# EAGLE schematic step_up_converter (EAGLE 7.1.0)
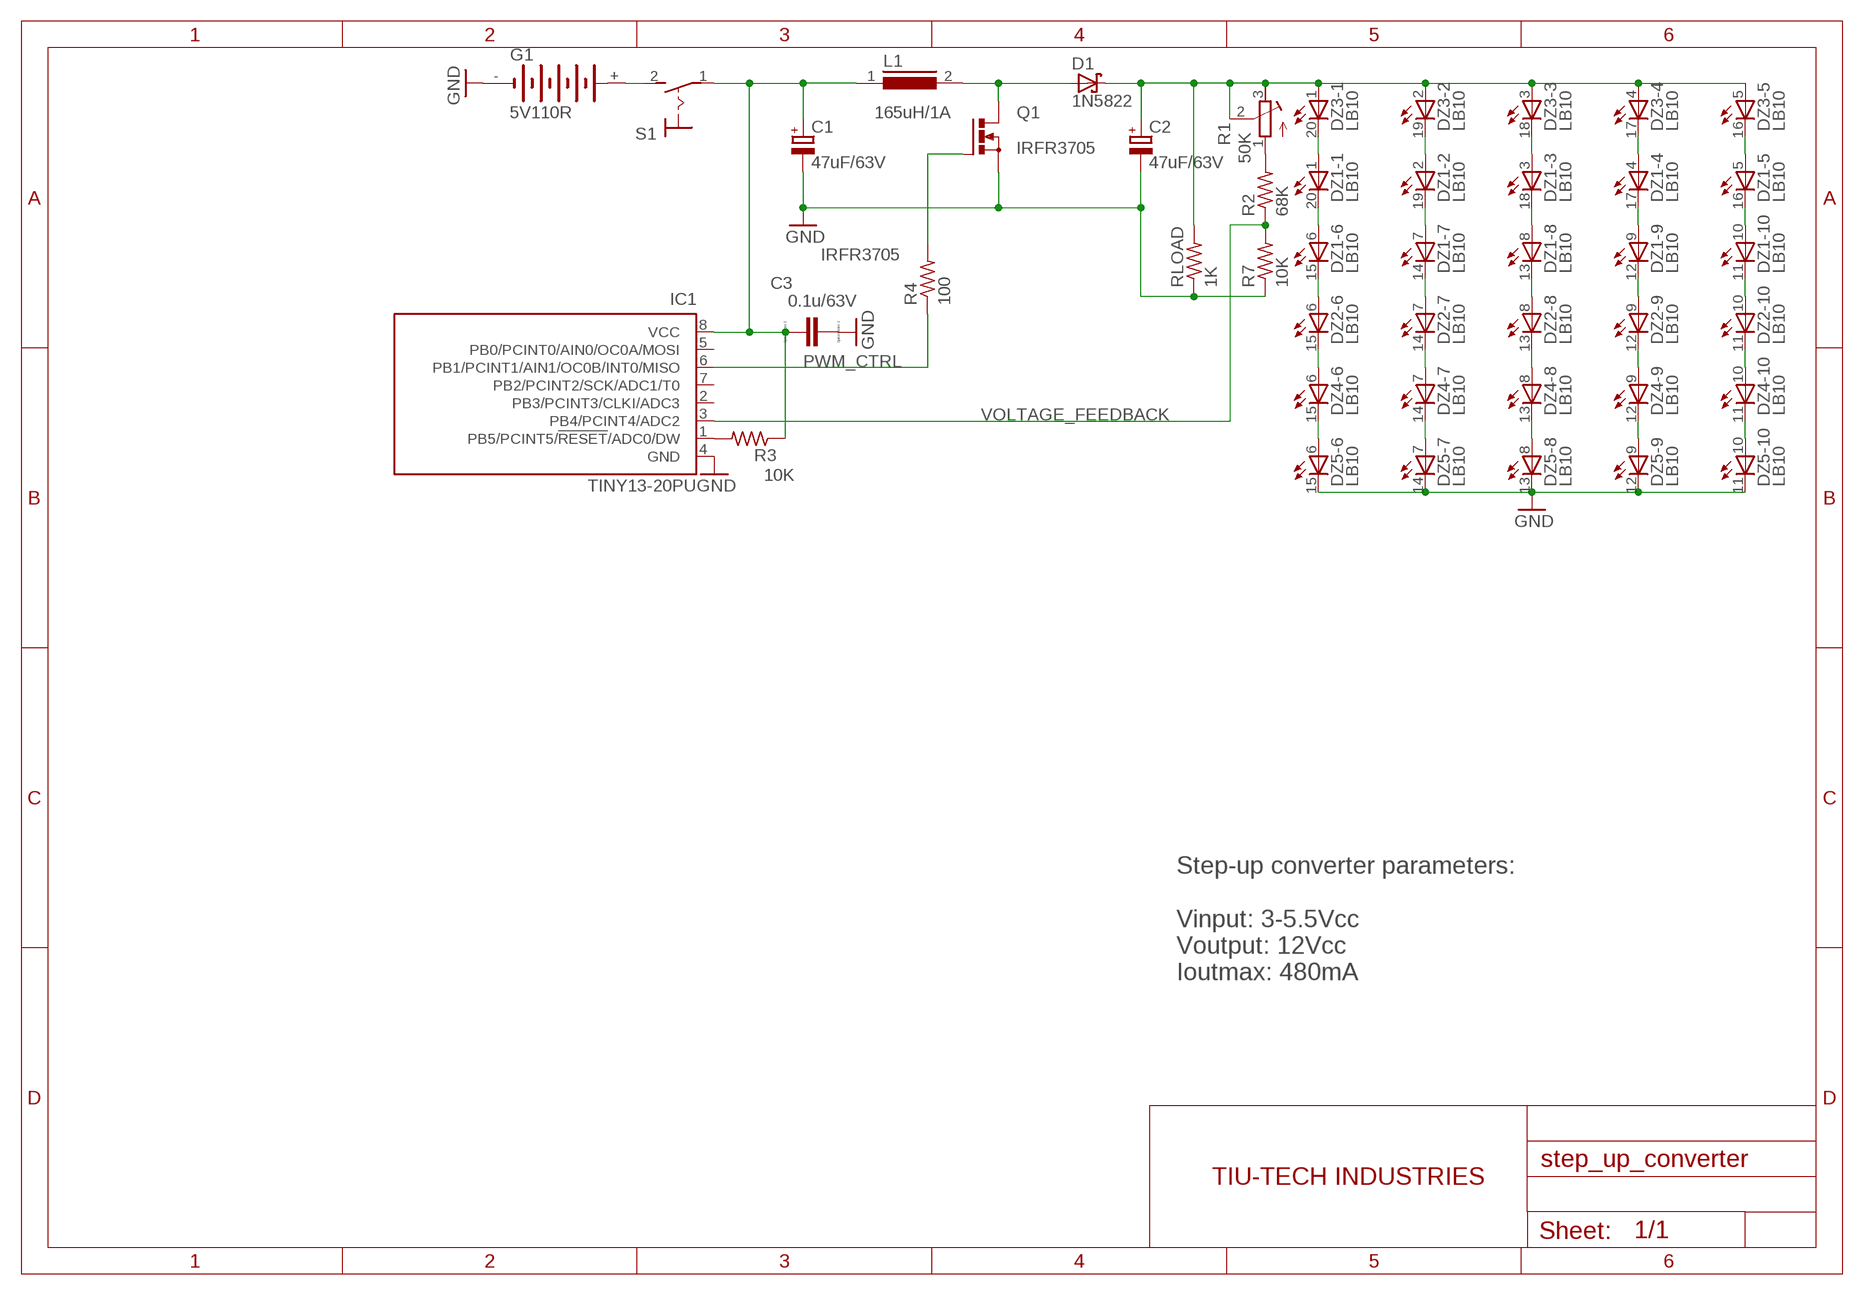
[diagram p0: schematic, sheet 1]

## Parts
C1  47uF/63V  CPOL-EUE2.5-6  [E2,5-6]
C2  47uF/63V  CPOL-EUE2.5-6  [E2,5-6]
C3  0.1u/63V  C-EU025-024X044  [C025-024X044]
D1  1N5822  SCHOTTKY-DIODECB429-17  [CB429-17]
DZ1  LB10  [LB10]
DZ2  LB10  [LB10]
DZ3  LB10  [LB10]
DZ4  LB10  [LB10]
DZ5  LB10  [LB10]
G1  5V110R  [5V110R]
IC1  TINY13-20PU  [DIL08]
L1  82114R  [82114R]
R1  50K  R-TRIMM64P  [RTRIM64P]
R2  68K  R-US_0204/5  [0204/5]
R3  10K  R-US_0204/5  [0204/5]
R4  100  R-US_0204/5  [0204/5]
R7  10K  R-US_0204/5  [0204/5]
RLOAD  1K  R-US_0204/5  [0204/5]
S1  MS243  [MS243]

## Nets
GND: C1.- C2.- C3.1 DZ5.11(-10:C) DZ5.12(-9:C) DZ5.13(-8:C) DZ5.14(-7:C) DZ5.15(-6:C) G1.- IC1.4(GND) R7.1 RLOAD.1
MCU_VSUPPLY: C1.+ C3.2 IC1.8(VCC) L1.1 R3.1 S1.1(P)
N$1: R1.1(E) R2.2
N$2: D1.A L1.2
N$3: IC1.1(PB5/PCINT5/!RESET!/ADC0/DW) R3.2
N$4: R4.2
N$5: DZ1.6(-6:A) DZ1.20(-1:C)
N$6: DZ1.7(-7:A) DZ1.19(-2:C)
N$7: DZ1.8(-8:A) DZ1.18(-3:C)
N$8: DZ1.9(-9:A) DZ1.17(-4:C)
N$9: DZ1.10(-10:A) DZ1.16(-5:C)
N$10: DZ1.15(-6:C) DZ2.6(-6:A)
N$11: DZ1.14(-7:C) DZ2.7(-7:A)
N$12: DZ1.13(-8:C) DZ2.8(-8:A)
N$13: DZ1.12(-9:C) DZ2.9(-9:A)
N$14: DZ1.11(-10:C) DZ2.10(-10:A)
N$15: DZ1.1(-1:A) DZ3.20(-1:C)
N$16: DZ1.2(-2:A) DZ3.19(-2:C)
N$17: DZ1.3(-3:A) DZ3.18(-3:C)
N$18: DZ1.4(-4:A) DZ3.17(-4:C)
N$19: DZ1.5(-5:A) DZ3.16(-5:C)
N$20: DZ2.15(-6:C) DZ4.6(-6:A)
N$21: DZ2.14(-7:C) DZ4.7(-7:A)
N$22: DZ2.13(-8:C) DZ4.8(-8:A)
N$23: DZ2.12(-9:C) DZ4.9(-9:A)
N$24: DZ2.11(-10:C) DZ4.10(-10:A)
N$25: DZ4.15(-6:C) DZ5.6(-6:A)
N$26: DZ4.14(-7:C) DZ5.7(-7:A)
N$27: DZ4.13(-8:C) DZ5.8(-8:A)
N$28: DZ4.12(-9:C) DZ5.9(-9:A)
N$29: DZ4.11(-10:C) DZ5.10(-10:A)
N$30: C2.+ D1.C DZ3.1(-1:A) DZ3.2(-2:A) DZ3.3(-3:A) DZ3.4(-4:A) DZ3.5(-5:A) R1.2(S) R1.3(A) RLOAD.2
N$33: G1.+ S1.2(S)
PWM_CTRL: IC1.6(PB1/PCINT1/AIN1/OC0B/INT0/MISO) R4.1
VOLTAGE_FEEDBACK: IC1.3(PB4/PCINT4/ADC2) R2.1 R7.2
Unconnected: DZ2.1(-1:A) DZ2.2(-2:A) DZ2.3(-3:A) DZ2.4(-4:A) DZ2.5(-5:A) DZ2.16(-5:C) DZ2.17(-4:C) DZ2.18(-3:C) DZ2.19(-2:C) DZ2.20(-1:C) DZ3.6(-6:A) DZ3.7(-7:A) DZ3.8(-8:A) DZ3.9(-9:A) DZ3.10(-10:A) DZ3.11(-10:C) DZ3.12(-9:C) DZ3.13(-8:C) DZ3.14(-7:C) DZ3.15(-6:C) DZ4.1(-1:A) DZ4.2(-2:A) DZ4.3(-3:A) DZ4.4(-4:A) DZ4.5(-5:A) DZ4.16(-5:C) DZ4.17(-4:C) DZ4.18(-3:C) DZ4.19(-2:C) DZ4.20(-1:C) DZ5.1(-1:A) DZ5.2(-2:A) DZ5.3(-3:A) DZ5.4(-4:A) DZ5.5(-5:A) DZ5.16(-5:C) DZ5.17(-4:C) DZ5.18(-3:C) DZ5.19(-2:C) DZ5.20(-1:C) G1.+@1(+) IC1.2(PB3/PCINT3/CLKI/ADC3) IC1.5(PB0/PCINT0/AIN0/OC0A/MOSI) IC1.7(PB2/PCINT2/SCK/ADC1/T0)

## Notes on the sheet
- 165uH/1A
- IRFR3705
- IRFR3705
- Step-up converter parameters:
  
  Vinput: 3-5.5Vcc
  Voutput: 12Vcc
  Ioutmax: 480mA
- TIU-TECH INDUSTRIES

## Library data of the parts
C1 C2 = resistor:CPOL-EU: POLARIZED CAPACITOR, European symbol
C3 = resistor:C-EU: CAPACITOR, European symbol; SPICEPREFIX: C
D1 = diode:SCHOTTKY-DIODE: Schottky Diode
DZ1-DZ5 = led:LB10: LED BLOCK 10-LED bar graph, DIL, Siemens
G1 = battery:5V110R: NC ACCU Varta
IC1 = atmel:TINY13: 8-bit AVR Microcontroller with 1K Bytes In-System Programmable Flash Source: http://www.atmel.com/dyn/resources/prod_documents/2535S.pdf; MPN: ATTINY13-20PU; OC_FARNELL: 9171550; OC_NEWARK: 96K6521
L1 = inductors:82114R: INDUCTOR
R1 = resistor:R-TRIMM: Trimm resistor
R2-R4 R7 RLOAD = resistor:R-US_: RESISTOR, American symbol
S1 = switch:MS243: TOGGLE SWITCH